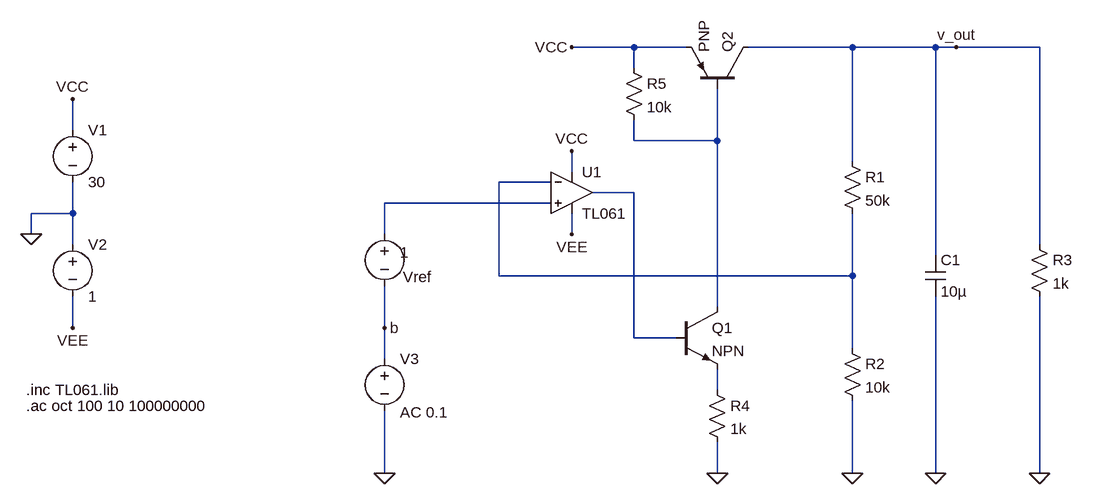
[diagram p0: schematic high_OLG_regulator_bode.asc]
high_OLG_regulator_bode.asc, the LTspice schematic file:
Version 4
SHEET 1 1208 680
WIRE 288 -176 192 -176
WIRE 368 -176 288 -176
WIRE 624 -176 464 -176
WIRE 752 -176 624 -176
WIRE 784 -176 752 -176
WIRE 912 -176 784 -176
WIRE 288 -144 288 -176
WIRE -576 -48 -576 -96
WIRE 288 -32 288 -64
WIRE 416 -32 416 -112
WIRE 416 -32 288 -32
WIRE 624 0 624 -176
WIRE 192 16 192 -16
WIRE 160 32 80 32
WIRE 288 48 224 48
WIRE 160 64 -96 64
WIRE -576 80 -576 32
WIRE -576 80 -640 80
WIRE -640 112 -640 80
WIRE -96 112 -96 64
WIRE 192 112 192 80
WIRE -576 128 -576 80
WIRE 912 128 912 -176
WIRE 752 144 752 -176
WIRE 80 176 80 32
WIRE 624 176 624 80
WIRE 624 176 80 176
WIRE 416 224 416 -32
WIRE -576 256 -576 208
WIRE -96 256 -96 192
WIRE 288 272 288 48
WIRE 352 272 288 272
WIRE 624 288 624 176
WIRE -96 304 -96 256
WIRE 416 352 416 320
WIRE -96 480 -96 384
WIRE 416 480 416 432
WIRE 624 480 624 368
WIRE 752 480 752 208
WIRE 912 480 912 208
FLAG -640 112 0
FLAG -96 480 0
FLAG 192 -16 VCC
FLAG -576 -96 VCC
FLAG 192 112 VEE
FLAG -576 256 VEE
FLAG 624 480 0
FLAG 192 -176 VCC
FLAG 784 -176 v_out
FLAG -96 256 b
FLAG 752 480 0
FLAG 912 480 0
FLAG 416 480 0
SYMBOL OpAmps\\UniversalOpAmp2 192 48 R0
SYMATTR InstName U1
SYMATTR Value TL061
SYMBOL voltage -576 -64 R0
WINDOW 123 0 0 Left 0
WINDOW 39 0 0 Left 0
SYMATTR InstName V1
SYMATTR Value 30
SYMBOL voltage -576 112 R0
WINDOW 123 0 0 Left 0
WINDOW 39 0 0 Left 0
SYMATTR InstName V2
SYMATTR Value 1
SYMBOL voltage -96 96 R0
WINDOW 123 24 124 Left 2
WINDOW 39 0 0 Left 0
WINDOW 0 28 82 Left 2
WINDOW 3 24 44 Left 2
SYMATTR InstName Vref
SYMATTR Value 1
SYMBOL res 608 -16 R0
SYMATTR InstName R1
SYMATTR Value 50k
SYMBOL res 608 272 R0
SYMATTR InstName R2
SYMATTR Value 10k
SYMBOL voltage -96 288 R0
WINDOW 123 24 98 Left 2
WINDOW 39 0 0 Left 0
SYMATTR Value2 AC 0.1
SYMATTR InstName V3
SYMATTR Value ""
SYMBOL cap 736 144 R0
SYMATTR InstName C1
SYMATTR Value 10µ
SYMATTR SpiceLine Rser=1
SYMBOL res 896 112 R0
SYMATTR InstName R3
SYMATTR Value 1k
SYMBOL npn 352 224 R0
SYMATTR InstName Q1
SYMBOL res 400 336 R0
SYMATTR InstName R4
SYMATTR Value 1k
SYMBOL res 272 -160 R0
SYMATTR InstName R5
SYMATTR Value 10k
SYMBOL pnp 464 -112 M270
SYMATTR InstName Q2
TEXT -648 352 Left 2 !.inc TL061.lib
TEXT -648 376 Left 2 !.ac oct 100 10 100000000

The netlist it stands for:
* high_OLG_regulator_bode.asc
XU1 N004 N002 VCC VEE N003 level2 TL061 Avol=1Meg GBW=10Meg Slew=10Meg Ilimit=25m Rail=0 Vos=0 En=0 Enk=0 In=0 Ink=0 Rin=500Meg  ; pins In+ In- V+ V- OUT
V1 VCC 0 30
V2 0 VEE 1
Vref N004 b 1
R1 v_out N002 50k
R2 N002 0 10k
V3 b 0 AC 0.1
C1 v_out 0 10µ Rser=1
R3 v_out 0 1k
Q1 N001 N003 N005 0 NPN
R4 N005 0 1k
R5 VCC N001 10k
Q2 v_out N001 VCC 0 PNP
.model NPN NPN
.model PNP PNP
.lib standard.bjt
.inc TL061.lib
.ac oct 100 10 100000000
.lib UniversalOpAmp2.lib
.backanno
.end